# EAGLE design digitaalitekniikka_555_blinker (EAGLE 9.3.0)
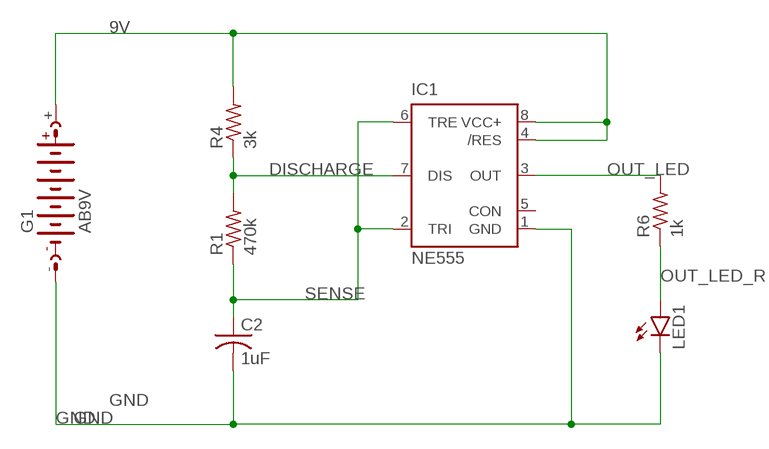
[diagram p0: schematic, sheet 1]

## Parts
C2  1uF  C-USC0805  [C0805]
G1  AB9V  [AB9V]
IC1  NE555  [DIL-08]
LED1  LEDCHIPLED_0805  [CHIPLED_0805]
R1  470k  R-US_R0805  [R0805]
R4  3k  R-US_R0805  [R0805]
R6  1k  R-US_R0805  [R0805]

## Nets
9V: G1.+ IC1.4(/RES) IC1.8(VCC+) R4.2
DISCHARGE: IC1.7(DIS) R1.2 R4.1
GND: C2.2 G1.- IC1.1(GND) LED1.C
OUT_LED: IC1.3(OUT) R6.2
OUT_LED_R: LED1.A R6.1
SENSE: C2.1 IC1.2(TRI) IC1.6(TRE) R1.1
Unconnected: IC1.5(CON)

## Library data of the parts
C2 = rcl:C-US: CAPACITOR, American symbol; SPICEPREFIX: C
G1 = battery:AB9V: 9-V BATTERY CLIP
IC1 = st-microelectronics:NE555: General purpose bipolar Timer; MF: Arrow Electronics; MPN: NE555N; OC_FARNELL: 1467742; OC_NEWARK: 89K1486
LED1 = led:LED: LED OSRAM: - CHIPLED LG R971, LG N971, LY N971, LG Q971, LY Q971, LO R971, LY R971 LH N974, LH R974 LS Q976, LO Q976, LY Q976 LO Q996 - Hyper CHIPLED LW Q18S LB Q993, LB Q99A, LB R99A - SideLED LS A670, LO A670, LY A670, LG A670, LP A670 LB A673, LV A673, LT A673, LW A673 LH A674 LY A675 LS A676, LA A676, LO A676, LY A676, LW A676 LS A679, LY A679, LG A679 - Hyper Micro SIDELED® LS Y876, LA Y876, LO Y876, LY Y876 LT Y87S - SmartLED LW L88C, LW L88S LB L89C, LB L89S, LG L890 LS L89K, LO L89K, LY L89K LS L896, LA L896, LO L896, LY L896 - TOPLED LS T670, LO T670, LY T670, LG T670, LP T670 LSG T670, LSP T670, LSY T670, LOP T670, LYG T670 LG T671, LOG T671, LSG T671 LB T673, LV T673, LT T673, LW T673 LH T674 LS T676, LA T676, LO T676, LY T676, LB T676, LH T676, LSB T676, LW T676 LB T67C, LV T67C, LT T67C, LS T67K, LO T67K, LY T67K, LW E67C LS E67B, LA E67B, LO E67B, LY E67B, LB E67C, LV E67C, LT E67C LW T67C LS T679, LY T679, LG T679 LS T770, LO T770, LY T770, LG T770, LP T770 LB T773, LV T773, LT T773, LW T773 LH T774 LS E675, LA E675, LY E675, LS T675 LS T776, LA T776, LO T776, LY T776, LB T776 LHGB T686 LT T68C, LB T68C - Hyper Mini TOPLED® LB M676 - Mini TOPLED Santana® LG M470 LS M47K, LO M47K, LY M47K Source: http://www.osram.convergy.de LUXEON: - LUMILED® LXK2-PW12-R00, LXK2-PW12-S00, LXK2-PW14-U00, LXK2-PW14-V00 LXK2-PM12-R00, LXK2-PM12-S00, LXK2-PM14-U00 LXK2-PE12-Q00, LXK2-PE12-R00, LXK2-PE12-S00, LXK2-PE14-T00, LXK2-PE14-U00 LXK2-PB12-K00, LXK2-PB12-L00, LXK2-PB12-M00, LXK2-PB14-N00, LXK2-PB14-P00, LXK2-PB14-Q00 LXK2-PR12-L00, LXK2-PR12-M00, LXK2-PR14-Q00, LXK2-PR14-R00 LXK2-PD12-Q00, LXK2-PD12-R00, LXK2-PD12-S00 LXK2-PH12-R00, LXK2-PH12-S00 LXK2-PL12-P00, LXK2-PL12-Q00, LXK2-PL12-R00 Source: www.luxeon.com KINGBRIGHT: KA-3528ASYC Source: www.kingbright.com
R1 R4 R6 = rcl:R-US_: RESISTOR, American symbol; SPICEPREFIX: R

## Board
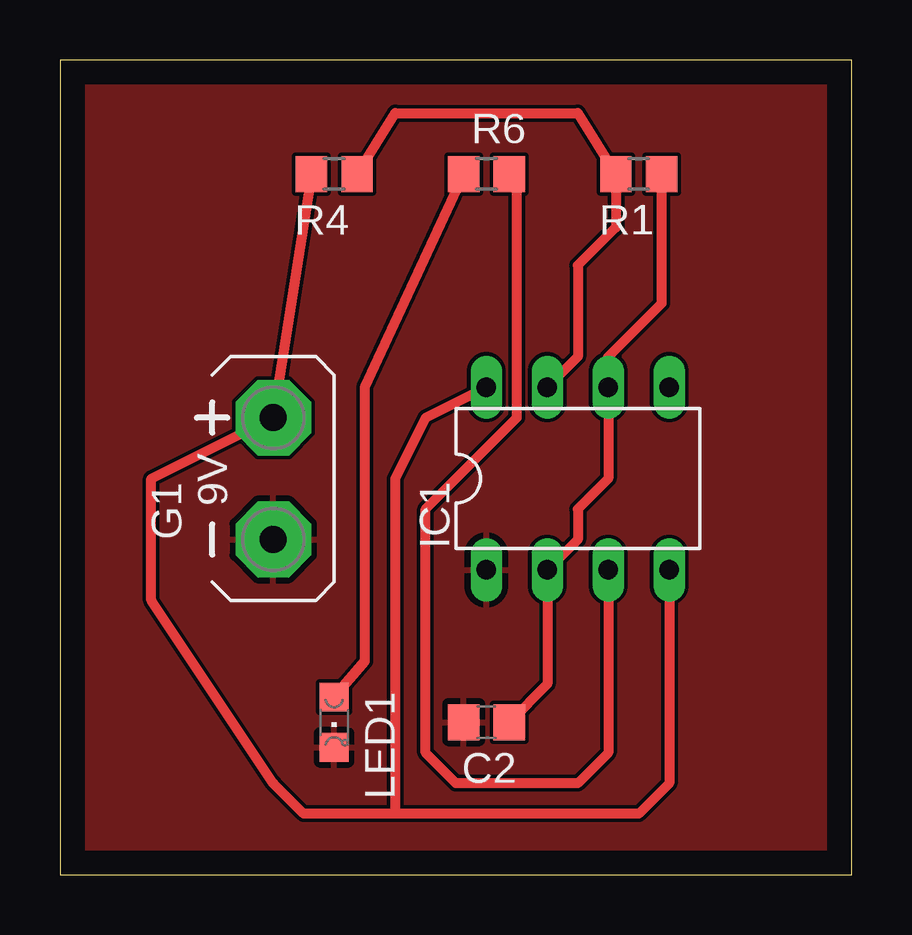
[diagram p1: board, top side]

Size 33 x 33.96 mm. Coordinates in mm from the lower left corner, seen from the top.
Outline: 0,0 33,0 33,33.96 0,33.96 0,0
Copper layers (1*16): Top 0.035mm / dielectric 1.5mm / Bottom 0.035mm
Design rules "default": minimum track width 6mil, minimum drill 0.35mm, track to track 6mil, track to pad 6mil, pad to pad 6mil, via to via 6mil, smd to smd 6mil, copper to edge 40mil, drill to drill 6mil, minimum pad ring 10mil, minimum via ring 8mil, stop-mask expansion 4mil, vias tented up to drill 0mil, thermal gap 10mil

### Footprints (pad centres in the part's own frame; a part is rotated, then mirrored left to right if it is on the bottom)
C0805 = smd 1.3 x 1.5: 1 -0.95,0; 2 0.95,0
AB9V = drill 1.118 pad 3.15 octagon: + 0,2.54; - 0,-2.54
DIL-08 = drill 0.813 long: 1 -3.81,-3.81; 2 -1.27,-3.81; 3 1.27,-3.81; 4 3.81,-3.81; 5 3.81,3.81; 6 1.27,3.81; 7 -1.27,3.81; 8 -3.81,3.81
CHIPLED_0805 = smd 1.2 x 1.2: A 0,-1.05; C 0,1.05
R0805 = smd 1.3 x 1.5: 1 -0.95,0; 2 0.95,0

### Placement (x,y rotation side)
C2  17.78,6.35 180 top
G1  8.89,16.51 0 top
IC1  21.59,16.51 0 top
LED1  11.43,6.35 180 top
R1  24.13,29.21 180 top
R4  11.43,29.21 180 top
R6  17.78,29.21 0 top

### Tracks (layer width: path | path; a pad name or v marks a point on that pad's centre or on a via)
9V
  Top 0.406: R4.2 G1.+ 3.81,16.51 3.81,11.43 8.89,3.81 10.16,2.54 13.97,2.54 | IC1.8 15.24,19.05 13.97,16.51 13.97,2.54 | IC1.4 25.4,3.81 24.13,2.54 13.97,2.54
DISCHARGE
  Top 0.406: R4.1 13.97,31.75 21.59,31.75 R1.2 23.18,26.99 21.59,25.4 21.59,21.59 IC1.7
GND
  pour Top: 0,34.29 33.02,34.29 33.02,0 0,0
OUT_LED
  Top 0.406: IC1.3 22.86,5.08 21.59,3.81 16.51,3.81 15.24,5.08 15.24,15.24 19.05,19.05 19.05,28.89 R6.2
OUT_LED_R
  Top 0.406: R6.1 12.7,20.32 12.7,8.89 LED1.A
SENSE
  Top 0.406: C2.1 20.32,7.94 IC1.2 21.59,13.97 21.59,15.24 22.86,16.51 IC1.6 22.86,21.59 25.08,23.81 R1.1